# EasyEDA Pro project ProPrj_FOC12_2025-04-03.epro, board PCB2
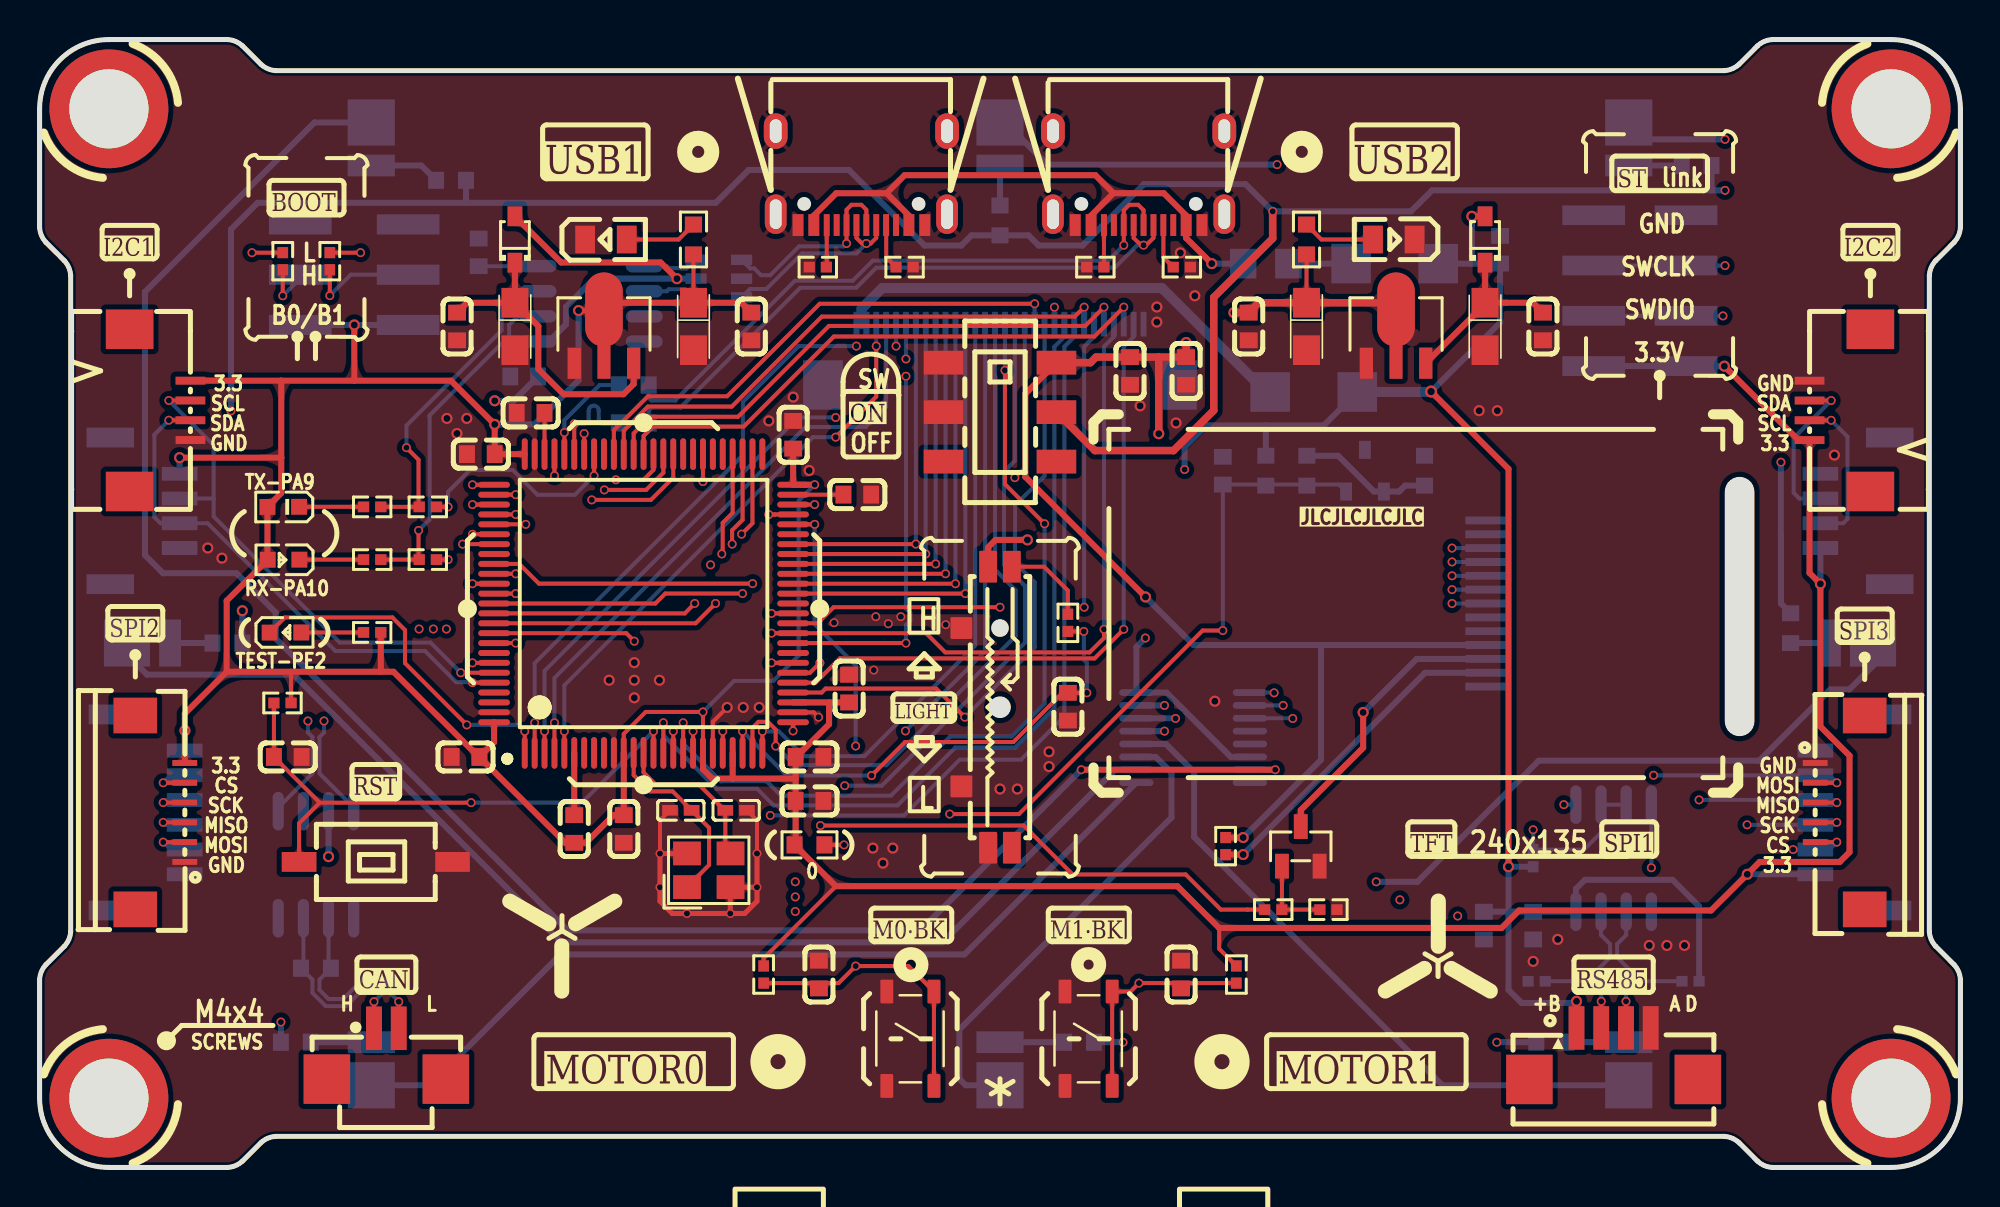
[diagram p10: board, top side]
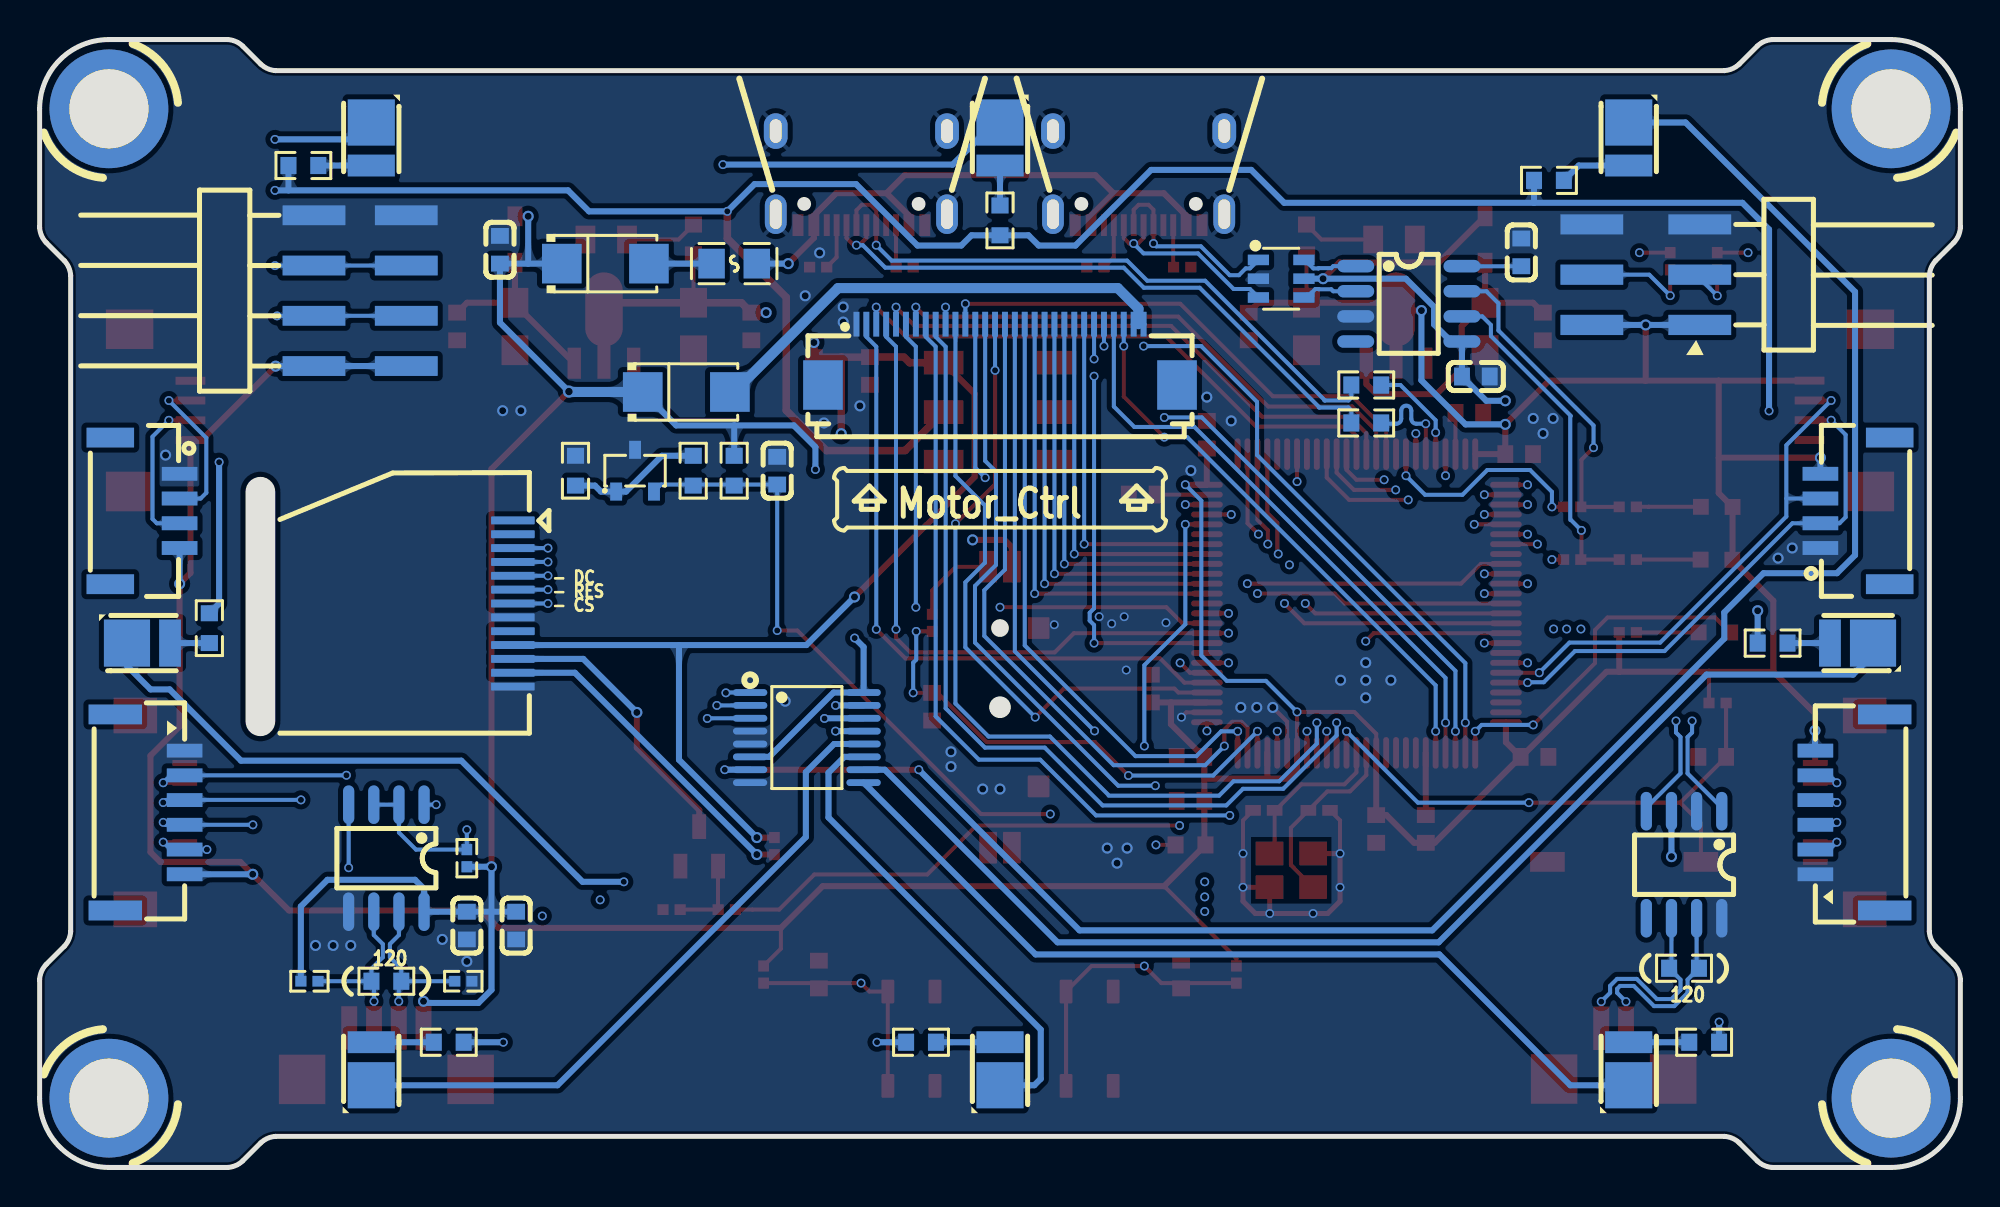
[diagram p11: board, bottom side, seen from below]

Outline 97 x 57 mm; copper layers: Top Layer, Inner1, Inner2, Bottom Layer. Coordinates in mm from the lower left corner of the outline.
Outline path: 0,53.5 0,47.5 arc(0.1,47.1) 0.33,46.75 1.24,45.83 arc(1.47,45.48) 1.57,45.08 1.57,11.92 arc(1.47,11.52) 1.24,11.17 0.33,10.25 arc(0.1,9.9) 0,9.5 0,3.5 arc(1.03,1.03) 3.5,0 9.5,0 arc(9.9,0.1) 10.25,0.32 11.17,1.24 arc(11.52,1.47) 11.92,1.57 85.08,1.57 arc(85.48,1.47) 85.83,1.24 86.75,0.32 arc(87.1,0.1) 87.5,0 93.5,0 arc(95.97,1.03) 97,3.5 97,9.5 arc(96.9,9.9) 96.68,10.25 95.76,11.17 arc(95.53,11.52) 95.43,11.92 95.43,45.08 arc(95.53,45.48) 95.76,45.83 96.68,46.75 arc(96.9,47.1) 97,47.5 97,53.5 arc(95.97,55.97) 93.5,57 87.5,57 arc(87.1,56.9) 86.75,56.67 85.83,55.76 arc(85.48,55.53) 85.08,55.43 11.92,55.43 arc(11.52,55.53) 11.17,55.76 10.25,56.67 arc(9.9,56.9) 9.5,57 3.5,57 arc(1.03,55.97) 0,53.5
Stack: Top Layer 0.035mm 外层铜厚1oz / Dielectric1 0.2104mm 7628 RC49% 8.6mil / Inner1 0.0152mm 内层铜厚 / Dielectric2 1.065mm 1.1mm H/HOZ Copper / Inner2 0.0152mm 内层铜厚 / Dielectric3 0.2104mm 7628 RC49% 8.6mil / Bottom Layer 0.035mm 外层铜厚1oz

## Design rules (mm)
net D+: DP1
net D-: DP1
net USB-: DP3
net USB+: DP3
net $1N25478: DP6
net $1N25477: DP6
net CAN_L: DP5
net CAN_H: DP5
net OTG_D+: DP2
net OTG_D-: DP2
net PA12: DP4
net PA11: DP4
net CAN1_TX: DP7
net CAN1_RX: DP7
template: 自定义配置
spacing copperThickness1oz (default): track to track 0.102, other pairs 0.152 to 0.3
spacing copperThickness2oz: track to track 0.203, other pairs 0.152 to 0.3
track width copperThickness1oz (default): min 0.127, default 0.254, max 2.54
track width copperThickness2oz: min 0.203, default 0.254, max 2.54
differential pair differentialPair (default): width min 0.127, default 0.254, max 2.54; gap min 0.152, default 0.152
via viaSize (default): diameter min 0.45, default 0.61, max 10; hole min 0.3, default 0.305, max 6.299

## Placement (name value [footprint] x y rotation side)
C1  1uF  [C0603]  27 17.1 90 top
C2  14pF  [C0402]  35.18 18.05 0 top
C3  22uF  [CASE-A_3216]  24 42.5 270 top
C4  100nF  [C0603]  21.08 42.5 90 top
C5  22uF  [CASE-A_3216]  33.02 42.5 270 top
C6  100nF  [C0603]  35.94 42.5 90 top
C7  22uF  [CASE-A_3216]  73 42.5 270 top
C8  100nF  [C0603]  75.92 42.5 90 top
C9  22uF  [CASE-A_3216]  63.98 42.5 270 top
C10  100nF  [C0603]  61.06 42.5 90 top
C11  100nF  [C0603]  59.75 35.21 270 bottom
C12  14pF  [C0402]  32.38 18.05 180 top
C13  2.2uF  [C0603]  24.8 38.13 0 top
C15  100nF  [C0603]  22.28 36.05 0 top
C16  100nF  [C0603]  38.06 37.03 270 top
C17  100nF  [C0603]  21.51 20.75 0 top
C18  100nF  [C0603]  40.88 24.2 270 top
C19  100nF  [C0603]  38.88 18.52 180 top
C20  100nF  [C0603]  38.88 20.75 180 top
C21  100nF  [C0603]  29.5 17.1 90 top
C23  2.2uF  [C0603]  41.29 34 180 top
C24  4.7uF  [C0603]  72.94 12.22 90 bottom
C25  2.2uF  [C0603]  73.75 46.38 270 bottom
C26  100nF  [C0603]  22.17 46.24 90 bottom
C27  100nF  [C0603]  75.42 12.22 90 bottom
C28  100nF  [C0603]  12.53 20.75 180 top
C29  100nF  [C0603]  24.47 39.97 0 bottom
C30  100nF  [C0603]  55.07 40.25 90 top
C31  4.7uF  [C0603]  57.9 40.25 90 top
C32  100nF  [C0603]  39.36 9.75 270 top
C33  100nF  [C0603]  57.64 9.75 270 top
C34  4.7uF  [C0603]  51.93 23.28 270 top
CN1  HC-1.25-4PWT  [CONN-SMD_4P-P1.25-HC-1.25-4PWT]  79.49 5.75 0 top
CN2  HC-GH-4PWT  [CONN-SMD_HC-GH-4PWT]  5.32 33.18 90 bottom
CN3  HC-GH-4PWT  [CONN-SMD_HC-GH-4PWT]  91.68 33.18 270 bottom
CN4  HC-1.25-2PWT  [CONN-SMD_2P-P1.25-HC-1.25-2PWT]  17.51 5.75 0 top
D1  1N5819WS  [SOD-323_L1.8-W1.3-LS2.5-RD]  24 46.9 90 top
D2  1N5819WS  [SOD-323_L1.8-W1.3-LS2.5-RD]  73 46.9 90 top
D3  USBLC6-2SC6  [SOT-23-6_L2.9-W1.6-P0.95-LS2.8-BL]  34.3 44.92 270 bottom
D4  SS34  [SMA_L4.3-W2.6-LS5.2-RD]  68.43 45.68 180 bottom
D5  SS34  [SMA_L4.3-W2.6-LS5.2-RD]  64.34 39.19 180 bottom
F1  SMD0805-100  [F0805]  61.92 45.68 0 bottom
FPC1  FPC-05F-30PH20  [FPC-SMD_30P-P0.50_XUNPU_FPC-05F-30PH20]  48.5 41.08 180 bottom
FPC2  AFA01-S04FCC-00  [FPC-SMD_AFA01-S04FCC-00]  6.08 38.26 270 top
FPC3  AFA01-S04FCC-00  [FPC-SMD_AFA01-S04FCC-00]  90.92 38.26 90 top
FPC4  AFA01-S06FCC-00  [FPC-SMD_6P-P1.00_AFA01-S06]  6.08 17.94 270 top
FPC5  AFA01-S06FCC-00  [FPC-SMD_6P-P1.00_AFA01-S06]  90.92 17.94 90 top
H1  PZ254-2-04-WS  [HDR-SMD_8P-P2.54-H-M-R2-C4_2]  80.81 44.31 270 bottom
LED1  XL-1608UGC-04_绿  [LED0603-RD_GREEN]  12.31 33.38 180 top
LED2  XL-1608UBC-04_蓝  [LED0603-RD_BLUE]  12.32 30.71 180 top
LED3  KT-0805Y_黄  [LED0805-R-RD]  68.39 46.9 180 top
LED4  NCD0603R1_红  [LED0603-RD_RED]  12.42 27.03 0 top
LED5  KT-0805Y_黄  [LED0805-R-RD]  28.6 46.9 0 top
LED6  HL-AM-2835H489W-S1-08HL-HR3  [LED-SMD_L3.3-W2.8-RD]  48.5 51.72 270 bottom
LED7  HL-AM-2835H489W-S1-08HL-HR3  [LED-SMD_L3.3-W2.8-RD]  80.25 51.72 270 bottom
LED8  HL-AM-2835H489W-S1-08HL-HR3  [LED-SMD_L3.3-W2.8-RD]  91.5 26.5 180 bottom
LED9  HL-AM-2835H489W-S1-08HL-HR3  [LED-SMD_L3.3-W2.8-RD]  80.25 5.24 90 bottom
LED10  HL-AM-2835H489W-S1-08HL-HR3  [LED-SMD_L3.3-W2.8-RD]  48.5 5.24 90 bottom
LED11  HL-AM-2835H489W-S1-08HL-HR3  [LED-SMD_L3.3-W2.8-RD]  5.5 26.5 0 bottom
LED12  HL-AM-2835H489W-S1-08HL-HR3  [LED-SMD_L3.3-W2.8-RD]  16.75 51.72 270 bottom
LED13  HL-AM-2835H489W-S1-08HL-HR3  [LED-SMD_L3.3-W2.8-RD]  16.75 5.24 90 bottom
NOREF  -  [Pad_e236]  93.5 53.5 90 top
NOREF#2  -  [Pad_e219]  93.5 3.5 0 top
NOREF#3  -  [Pad_e35]  3.5 3.5 270 top
NOREF#4  -  [Pad_e18]  3.5 53.5 180 top
Q1  AMS1117-3.3V  [SOT-89-3_L4.5-W2.5-P1.50-LS4.2-BR]  28.5 42 270 top
Q2  AMS1117-3.3V  [SOT-89-3_L4.5-W2.5-P1.50-LS4.2-BR]  68.5 42 270 top
Q3  S8050  [SOT-23-3_L2.9-W1.3-P1.90-LS2.4-BR]  63.69 16.23 270 top
R1  0603WAF1001T5E  [R0603]  61.92 35.21 270 bottom
R2  1.5kΩ  [R0603]  63.99 35.21 270 bottom
R3  4.7kΩ  [R0603]  69.94 35.21 270 bottom
R4  0Ω  [R0603]  38.88 16.3 0 top
R5  3kΩ  [R0402]  16.8 33.38 0 top
R6  3kΩ  [R0603]  63.98 46.9 270 top
R7  3kΩ  [R0402]  16.8 27.04 0 top
R8  100Ω  [R0402]  19.6 33.38 0 top
R9  1kΩ  [R0402]  16.8 30.72 0 top
R10  10kΩ  [R0402]  12.28 45.8 270 top
R11  10kΩ  [R0402]  14.65 45.8 270 top
R12  100Ω  [R0402]  19.6 30.72 0 top
R13  3kΩ  [R0603]  33.02 46.9 270 top
R14  10kΩ  [R0402]  12.27 23.47 0 top
R15  0402WGF5101TCE  [R0402]  43.68 45.5 180 top
R16  0402WGF5101TCE  [R0402]  57.68 45.5 180 top
R17  10kΩ  [R0402]  75.42 15.63 90 bottom
R18  0Ω  [R0603]  30 39.54 180 bottom
R19  0Ω  [R0603]  30 37.62 180 bottom
R20  1kΩ  [R0402]  75.6 9.41 180 bottom
R21  0402WGF5101TCE  [R0402]  39.3 45.5 0 top
R22  120Ω  [R0603]  79.49 9.41 180 bottom
R23  0402WGF5101TCE  [R0402]  53.32 45.5 0 top
R24  1kΩ  [R0402]  83.37 9.41 0 bottom
R25  1kΩ  [R0402]  51.93 27.52 90 top
R26  20Ω  [R0402]  59.89 16.24 90 top
R27  10kΩ  [R0402]  62.3 13.03 0 top
R28  10kΩ  [R0402]  36.56 9.75 270 top
R29  10kΩ  [R0402]  60.44 9.75 270 top
R30  10kΩ  [R0402]  65.09 13.03 0 top
R31  120Ω  [R0603]  13.96 10.07 180 bottom
R32  0603WAF1000T5E  [R0603]  48.5 47.86 270 bottom
R33  0603WAF1000T5E  [R0603]  83.68 50.64 0 bottom
R34  0603WAF1000T5E  [R0603]  88.43 27.25 90 bottom
R35  0603WAF1000T5E  [R0603]  76.34 6.33 180 bottom
R36  0603WAF1000T5E  [R0603]  52.49 6.33 0 bottom
R37  0603WAF1000T5E  [R0603]  20.78 49.89 0 bottom
R38  0603WAF1000T5E  [R0603]  9.48 26.5 0 bottom
R39  0603WAF1000T5E  [R0603]  12.94 6.33 180 bottom
SW1  TS-1107S-16  [SW-SMD_L6.0-W3.7-LS8.0]  16.98 15.44 180 top
SW2  MST22D18G2  [SW-SMD_MST22D18G2]  48.5 38.17 270 top
SW3  K2-1808SN-A3SW-01  [椭圆白头按钮开关]  44 6.5 90 top
SW4  K2-1808SN-A3SW-01  [椭圆白头按钮开关]  53 6.5 90 top
U1  STM32F407VET6  [LQFP-100_L14.0-W14.0-P0.50-LS16.0-BL]  30.5 28.5 0 top
U2  TL431  [SOT-23-3_L2.9-W1.4-P1.90-LS2.6-BR]  66.93 35.21 270 bottom
U4  PZ254-2-03-WS  [HDR-SMD_6P-P2.54-H-M-R2-C3-LS17.0]  15.89 45.12 90 bottom
U5  CH340N  [SOP-8_L4.9-W3.9-P1.27-LS6.0-BL]  27.85 43.64 270 bottom
U6  MAX13488EESA+T  [SOIC-8_L5.0-W4.0-P1.27-LS6.0-BL]  79.49 15.63 0 bottom
U7  -  [1.14 TFT_13P]  69.5 28.5 0 top
U8  HC-GH-6PWT  [CONN-SMD_6P-P1.25_HCTL_HC-GH-6PWT]  5.57 17.94 90 bottom
U9  HC-GH-6PWT  [CONN-SMD_6P-P1.25_HCTL_HC-GH-6PWT]  91.43 17.94 270 bottom
U10  -  [RS08U111Z001]  48.5 23.26 0 top
U11  TJA1050T/CM,118  [SOIC-8_L5.0-W4.0-P1.27-LS6.0-BL]  13.96 15.3 0 bottom
U12  SN74HC138PWR  [TSSOP-16_L5.0-W4.4-P0.65-LS6.4-BL]  58.25 21.72 270 bottom
USB1  TYPE-C 16PIN 2MD(073)  [USB-C-SMD_TYPE-C-6PIN-2MD-073]  41.5 50 180 top
USB2  TYPE-C 16PIN 2MD(073)  [USB-C-SMD_TYPE-C-6PIN-2MD-073]  55.5 50 180 top
X1  25MHz  [CRYSTAL-SMD_4P-L3.2-W2.5-BL]  33.79 15.02 0 top

## Footprints (pads in the part's own frame, mm; a bottom-side part is the same pattern mirrored in y, then rotated)
1.14 TFT_13P
  rrect 2.2x0.4 smd far side: 1(3.6,4.2) 2(3.6,3.5) 3(3.6,2.8) 4(3.6,2.1) 5(3.6,1.4) 6(3.6,0.7) 7(3.6,0) 8(3.6,-0.7) 9(3.6,-1.4) 10(3.6,-2.1) 11(3.6,-2.8) 12(3.6,-3.5) 13(3.6,-4.2)
C0402
  rect 0.79x0.54 smd: 1(-0.545,0) 2(0.545,0)
C0603
  rect 0.8x0.9 smd: 1(-0.7,0) 2(0.7,0)
CASE-A_3216
  rect 1.5x1.359 smd: 1(-1.2,0) 2(1.2,0)
CONN-SMD_2P-P1.25-HC-1.25-2PWT
  rect 0.8x2.2 smd: 1(-0.625,1.285) 2(0.625,1.285)
  rect 2.35x2.5 smd: 3(-3.005,-1.285) 4(3.005,-1.285)
CONN-SMD_4P-P1.25-HC-1.25-4PWT
  rect 0.8x2.2 smd: 1(-1.875,1.3) 2(-0.625,1.3) 3(0.625,1.3) 4(1.875,1.3)
  rect 2.35x2.5 smd: 5(4.255,-1.3) 6(-4.255,-1.3)
CONN-SMD_6P-P1.25_HCTL_HC-GH-6PWT
  rect 0.7x1.8 smd: 1(-3.125,1.75) 2(-1.875,1.75) 3(-0.625,1.75) 4(0.625,1.75) 5(1.875,1.75) 6(3.125,1.75)
  rect 1x2.7 smd: 7(4.955,-1.75) 8(-4.955,-1.75)
CONN-SMD_HC-GH-4PWT
  rect 0.7x1.8 smd: 1(-1.875,1.75) 2(-0.625,1.75) 3(0.625,1.75) 4(1.875,1.75)
  rect 1x2.4 smd: 5(3.705,-1.75) 6(-3.705,-1.75)
CRYSTAL-SMD_4P-L3.2-W2.5-BL
  rect 1.4x1.2 smd: 1(-1.1,-0.85) 2(1.1,-0.85) 3(1.1,0.85) 4(-1.1,0.85)
F0805
  rect 1.335x1.5 smd: 1(-1.143,0) 2(1.143,0)
FPC-SMD_6P-P1.00_AFA01-S06
  rect 0.299x1.25 smd: 1(2.499,1.25) 2(1.501,1.25) 3(0.5,1.25) 4(-0.5,1.25) 5(-1.498,1.25) 6(-2.499,1.25)
  rect 1.801x2.2 smd: 7(4.899,-1.25) 8(-4.899,-1.25)
FPC-SMD_30P-P0.50_XUNPU_FPC-05F-30PH20
  rect 0.3x1.25 smd: 1(-7.25,1.538) 2(-6.75,1.538) 3(-6.25,1.538) 4(-5.75,1.538) 5(-5.25,1.538) 6(-4.75,1.538) 7(-4.25,1.538) 8(-3.75,1.538) 9(-3.25,1.538) 10(-2.75,1.538) 11(-2.25,1.538) 12(-1.75,1.538) 13(-1.25,1.538) 14(-0.75,1.538) 15(-0.25,1.538) 16(0.25,1.538) 17(0.75,1.538) 18(1.25,1.538) 19(1.75,1.538) 20(2.25,1.538) 21(2.75,1.538) 22(3.25,1.538) 23(3.75,1.538) 24(4.25,1.538) 25(4.75,1.538) 26(5.25,1.538) 27(5.75,1.538) 28(6.25,1.538) 29(6.75,1.538) 30(7.25,1.538)
  rect 2x2.5 smd: 31(8.94,-1.538) 32(-8.94,-1.538)
FPC-SMD_AFA01-S04FCC-00
  rect 0.399x1.501 smd: 1(-1.501,1.536) 2(-0.5,1.536) 3(0.498,1.536) 4(1.498,1.536)
  rect 1.999x2.401 smd: 5(-4.099,-1.536) 6(4.099,-1.536)
HDR-SMD_6P-P2.54-H-M-R2-C3-LS17.0
  rect 1.02x3.17 smd: 1(-2.54,-2.725) 2(-2.54,2.725) 3(0,-2.725) 4(0,2.725) 5(2.54,-2.725) 6(2.54,2.725)
HDR-SMD_8P-P2.54-H-M-R2-C4_2
  rect 1x3.17 smd: 1(-3.81,2.33) 2(-3.81,-2.33) 3(-1.27,2.33) 4(-1.27,-2.33) 5(1.27,2.33) 6(1.27,-2.33) 7(3.81,2.33) 8(3.81,-2.33)
LED0603-RD_BLUE
  rect 0.8x0.8 smd: 1(-0.8,-0.003) 2(0.8,0.003)
LED0603-RD_GREEN
  rect 0.8x0.8 smd: 1(-0.799,-0.004) 2(0.799,0.004)
LED0603-RD_RED
  rect 0.8x0.8 smd: 1(-0.799,-0.004) 2(0.799,0.004)
LED0805-R-RD
  rect 1x1.399 smd: 1(1.05,0) 2(-1.05,0)
LED-SMD_L3.3-W2.8-RD
  rect 2.33x2.38 smd: 1(-1.087,0)
  rect 1.1x2.38 smd: 2(1.087,0)
LQFP-100_L14.0-W14.0-P0.50-LS16.0-BL
  oval 0.3x1.6 smd: 1(-6,-7.55) 2(-5.5,-7.55) 3(-5,-7.55) 4(-4.5,-7.55) 5(-4,-7.55) 6(-3.5,-7.55) 7(-3,-7.55) 8(-2.5,-7.55) 9(-2,-7.55) 10(-1.5,-7.55) 11(-1,-7.55) 12(-0.5,-7.55) 13(0,-7.55) 14(0.5,-7.55) 15(1,-7.55) 16(1.5,-7.55) 17(2,-7.55) 18(2.5,-7.55) 19(3,-7.55) 20(3.5,-7.55) 21(4,-7.55) 22(4.5,-7.55) 23(5,-7.55) 24(5.5,-7.55) 25(6,-7.55) 51(6,7.55) 52(5.5,7.55) 53(5,7.55) 54(4.5,7.55) 55(4,7.55) 56(3.5,7.55) 57(3,7.55) 58(2.5,7.55) 59(2,7.55) 60(1.5,7.55) 61(1,7.55) 62(0.5,7.55) 63(0,7.55) 64(-0.5,7.55) 65(-1,7.55) 66(-1.5,7.55) 67(-2,7.55) 68(-2.5,7.55) 69(-3,7.55) 70(-3.5,7.55) 71(-4,7.55) 72(-4.5,7.55) 73(-5,7.55) 74(-5.5,7.55) 75(-6,7.55)
  oval 1.6x0.3 smd: 26(7.55,-6) 27(7.55,-5.5) 28(7.55,-5) 29(7.55,-4.5) 30(7.55,-4) 31(7.55,-3.5) 32(7.55,-3) 33(7.55,-2.5) 34(7.55,-2) 35(7.55,-1.5) 36(7.55,-1) 37(7.55,-0.5) 38(7.55,0) 39(7.55,0.5) 40(7.55,1) 41(7.55,1.5) 42(7.55,2) 43(7.55,2.5) 44(7.55,3) 45(7.55,3.5) 46(7.55,4) 47(7.55,4.5) 48(7.55,5) 49(7.55,5.5) 50(7.55,6) 76(-7.55,6) 77(-7.55,5.5) 78(-7.55,5) 79(-7.55,4.5) 80(-7.55,4) 81(-7.55,3.5) 82(-7.55,3) 83(-7.55,2.5) 84(-7.55,2) 85(-7.55,1.5) 86(-7.55,1) 87(-7.55,0.5) 88(-7.55,0) 89(-7.55,-0.5) 90(-7.55,-1) 91(-7.55,-1.5) 92(-7.55,-2) 93(-7.55,-2.5) 94(-7.55,-3) 95(-7.55,-3.5) 96(-7.55,-4) 97(-7.55,-4.5) 98(-7.55,-5) 99(-7.55,-5.5) 100(-7.55,-6)
Pad_e18
  round 6 hole 4: 1(0,0)
Pad_e35
  round 6 hole 4: 1(0,0)
Pad_e219
  round 6 hole 4: 1(0,0)
Pad_e236
  round 6 hole 4: 1(0,0)
R0402
  rect 0.566x0.54 smd: 1(-0.433,0) 2(0.433,0)
R0603
  rect 0.806x0.864 smd: 1(-0.753,0) 2(0.753,0)
RS08U111Z001
  rrect 0.9x1.6 smd: 1(-0.6,7.1) 2(0.6,7.1) 3(0.6,-7.1) 4(-0.6,-7.1)
  rrect 1.1x1.1 smd: 5(-1.95,-4) 6(-1.95,4)
SMA_L4.3-W2.6-LS5.2-RD
  rect 2x2 smd: 1(-2.2,0) 2(2.2,0)
SOD-323_L1.8-W1.3-LS2.5-RD
  rect 1x0.75 smd: 1(-1.173,0) 2(1.173,0)
SOIC-8_L5.0-W4.0-P1.27-LS6.0-BL
  oval 0.569x1.95 smd: 1(-1.905,-2.705) 2(-0.635,-2.705) 3(0.635,-2.705) 4(1.905,-2.705) 5(1.905,2.705) 6(0.635,2.705) 7(-0.635,2.705) 8(-1.905,2.705)
SOP-8_L4.9-W3.9-P1.27-LS6.0-BL
  oval 0.63x1.865 smd: 1(-1.905,-2.683) 2(-0.635,-2.683) 3(0.635,-2.683) 4(1.905,-2.683) 5(1.905,2.683) 6(0.635,2.683) 7(-0.635,2.683) 8(-1.905,2.683)
SOT-23-3_L2.9-W1.3-P1.90-LS2.4-BR
  rect 1.25x0.7 smd: 1(1,-0.95) 2(1,0.95) 3(-1,0)
SOT-23-3_L2.9-W1.4-P1.90-LS2.6-BR
  rect 0.91x0.6 smd: 1(1.055,-0.955) 2(1.055,0.955) 3(-1.055,0)
SOT-23-6_L2.9-W1.6-P0.95-LS2.8-BL
  rect 0.532x1.072 smd: 1(-0.95,-1.149) 2(0,-1.149) 3(0.95,-1.149) 4(0.95,1.149) 5(0,1.149) 6(-0.95,1.149)
SOT-89-3_L4.5-W2.5-P1.50-LS4.2-BR
  rect 1.575x0.672 smd: 1(1.356,-1.5) 3(1.356,1.5)
  custom 5.377x1.9 smd: 2(-1.356,0)
SW-SMD_L6.0-W3.7-LS8.0
  rect 1.75x1 smd: 1(-3.875,0) 2(3.875,0)
SW-SMD_MST22D18G2
  rect 1.2x2 smd: 1(-2.5,2.85) 2(0,2.85) 3(2.5,2.85) 4(-2.5,-2.85) 5(0,-2.85) 6(2.5,-2.85)
TSSOP-16_L5.0-W4.4-P0.65-LS6.4-BL
  oval 0.343x1.732 smd: 1(-2.276,-2.865) 2(-1.625,-2.865) 3(-0.976,-2.865) 4(-0.325,-2.865) 5(0.325,-2.865) 6(0.976,-2.865) 7(1.625,-2.865) 8(2.276,-2.865) 9(2.276,2.865) 10(1.625,2.865) 11(0.976,2.865) 12(0.325,2.865) 13(-0.325,2.865) 14(-0.976,2.865) 15(-1.625,2.865) 16(-2.276,2.865)
USB-C-SMD_TYPE-C-6PIN-2MD-073
  rect 0.55x1.1 smd: 1(-3.2,2.375) 2(-2.4,2.375) 11(2.4,2.375) 12(3.2,2.375)
  rect 0.3x1.1 smd: 3(-1.75,2.375) 4(-1.25,2.375) 5(-0.75,2.375) 6(-0.25,2.375) 7(0.25,2.375) 8(0.75,2.375) 9(1.25,2.375) 10(1.75,2.375)
  oval 1.1x2 hole 0.6x1.5: 13(-4.325,1.825) 14(4.325,1.825)
  oval 1.2x1.8 hole 0.6x1.2: 13(-4.325,-2.375) 14(4.325,-2.375)
椭圆白头按钮开关
  rrect 1.2x0.65 smd: 1(-2.38,-1.164) 2(2.39,-1.164) 3(2.39,1.216) 4(-2.38,1.216)

## Nets
As in the schematic.

Pads without a net: CN1 5 6; CN2 5 6; CN3 5 6; CN4 3 4; FPC1 31 32; FPC2 5 6; FPC3 5 6; FPC4 7 8; FPC5 7 8; NOREF 1; NOREF#2 1; NOREF#3 1; NOREF#4 1; SW2 3 6; U1 7 8 9 33 38 45 51 55 56 58 59 67 83 93 97 98; U5 4; U7 1 2 9; U8 7 8; U9 7 8; U10 3; U11 5; USB1 3 9; USB2 3 9

## Via types
v1: diameter 0.559, hole 0.355, Top Layer to Bottom Layer, 62 vias
v2: diameter 0.45, hole 0.305, Top Layer to Bottom Layer, 183 vias
v3: diameter 0.61, hole 0.381, Top Layer to Bottom Layer, 1 via

## Routing (per net, layer and track width the routed paths; a pad name or vN(x,y) marks a point on that pad's centre or on a via; arc(x,y) is an arc through that point)
+3.3V_1: length 255.6
  Top Layer w0.203: R29.1 59.57,11.05 59.57,12.1 ; 11.51,30.72 11.52,30.71 ; U1.19 v2(33.5,23.02) 30.61,23.02 29.5,21.91 U1.11 ; C5.1 R13.2 ; R28.1 36.56,10.57 40.21,14.22 ; R14.2 12.7,25.05 ; 39.14,34.5 v2(39.14,34.5)
  Top Layer w0.305: 35,19.65 33.97,19.65 33.5,20.12 U1.19 ; 35,19.65 U1.22 ; 35,19.65 38.18,19.65 ; 12.2,39.76 15.89,39.76 ; 12.2,39.76 12.2,35.87 ; 12.2,39.76 7.62,39.76 ; 15.89,39.76 v1(15.89,42.58) ; 15.89,39.76 20.77,39.76 v1(22.98,37.55) C15.2 24.5,36.05 ; v1(27.22,43.31) 28.45,43.31 Q1.2 28.84,43.7 C5.1 35.44,43.7 C6.2 ; 40.91,23.5 39.87,23.5 ; 39.87,23.5 U1.28 ; 39.87,23.5 39.87,22.4 38.21,20.75 ; 12.2,35.87 v1(7.07,35.87) ; 12.2,35.87 12.2,34.08 LED1.2 11.51,30.72 ; 17.23,25.05 9.45,25.05 ; 17.23,25.05 17.87,25.05 22.17,20.75 ; 17.23,25.05 17.23,27.04 ; U1.11 C21.2 28.98,17.8 27.58,16.4 C1.1 26.55,16.4 C17.2 22.95,21.49 U1.100 ; 9.45,25.05 7.33,22.94 FPC4.6 ; 9.45,25.05 9.45,28.64 11.52,30.71 ; 38.18,16.35 C19.2 38.18,19.65 ; C16.2 38.06,34.5 ; C20.2 38.18,19.65 ; U1.50 39.14,34.5 ; R4.1 40.21,14.22 57.46,14.22 59.57,12.1 73.83,12.1 74.71,12.99 84.41,12.99 v1(86.24,14.82) 86.86,15.44 FPC5.6 90.91,15.44 91.4,15.93 91.4,20.81 89.93,22.28 v1(89.93,29.49) 89.38,30.04 FPC3.1 88.82,36.76 v1(85.08,40.5)
  Bottom Layer w0.203: v2(39.14,34.5) 38.33,33.7 38.33,25.87 37.05,24.59 35.07,24.59 v2(33.5,23.02)
  Bottom Layer w0.305: v1(22.98,37.55) 24.99,37.55 27.22,39.78 v1(27.22,43.31) ; U4.2 v1(15.89,42.58) U4.1 ; v1(89.93,29.49) CN3.4 ; v1(7.34,22.08) 7.34,21.08 U8.6 ; v1(86.24,14.82) U9.6 ; CN2.4 v1(7.07,35.87) ; H1.7 H1.8 ; 83.51,40.5 v1(85.08,40.5)
+3.3V_2: length 84.6
  Top Layer w0.203: R6.2 C9.1
  Top Layer w0.305: U10.1 47.9,31.34 48.27,31.72 v1(49.88,31.72) ; v1(55.85,28.83) 49.78,34.9 49.78,39.1 SW2.1 ; v1(60.78,16.67) R26.2
  Top Layer w0.381: v1(57.9,41.69) C31.2 56.52,40.95 ; Q2.2 68.16,43.7 C9.1 61.56,43.7 C10.2 v1(60.31,43.2) ; SW2.1 53.07,40.67 53.35,40.95 C30.2 56.52,40.95 ; 56.52,40.95 v1(56.52,37.08)
  Inner1 w0.508: v1(57.9,41.69) 59.41,43.2 v1(60.31,43.2)
  Inner2 w0.305: v1(56.52,37.08) 56.52,33.96 54.27,31.72 v1(49.88,31.72)
  Bottom Layer w0.305: 64.71,26.4 64.71,20.6 v1(60.78,16.67) ; 64.71,26.4 U7.10 ; 64.71,26.4 58.28,26.4 v1(55.85,28.83)
+5V: length 200.9
  Top Layer w0.305: 73,48.07 v1(72.33,48.07) ; D1.2 26.34,45.73 31.36,45.73 v1(32.18,44.92) ; 70.28,39.2 74.18,35.3 v1(74.18,15.2) ; CN1.1 77.61,8.39
  Top Layer w0.381: v3(70.27,39.21) 70.28,39.2
  Inner1 w0.305: v1(22.98,38.75) 19.88,38.75 18,36.87 18,29.79 12.53,24.33 12.53,21.75 14.59,19.69 v1(14.59,15.71)
  Inner1 w0.508: v1(32.18,44.92) 60.62,44.92 61.06,45.36 64.12,45.36 v3(70.27,39.21)
  Inner2 w0.305: v2(55.84,26.75) 57.82,28.73 v2(57.82,35.27)
  Bottom Layer w0.305: C24.2 74.18,12.92 ; 74.18,12.92 74.18,8.97 74.84,8.31 77.53,8.31 v1(77.61,8.4) ; 74.18,12.92 C27.2 U6.8 77.58,14.08 78.04,14.54 82.46,14.54 83.81,13.19 R24.2 ; 74.18,12.92 v1(74.18,15.2) R17.1 ; D5.1 64.85,37.5 61.92,37.5 ; v2(55.84,26.75) 55.39,26.3 U12.16 56.91,24 60.16,20.75 61.12,20.75 ; 72.33,45.68 C25.2 73.75,42.69 v3(70.27,39.21) ; 72.33,45.68 D4.1 ; 72.33,45.68 v1(72.33,48.07) ; 14.59,17.6 v1(14.59,15.71) ; D3.5 v1(32.18,44.92) 28,44.92 26.58,43.49 26.58,42.6 25.72,41.74 U5.5 C29.2 23.94,38.75 v1(22.98,38.75) ; 61.92,37.5 R1.1 ; 61.92,37.5 58.92,37.5 57.82,36.41 v2(57.82,35.27)
  Bottom Layer w0.508: D5.1 70.25,39.19
DGND: length 23.1
  Top Layer w0.203: v2(31.33,15.86) 31.33,17.54 C12.2 ; v1(34.72,23.25) 34,22.52 U1.20 ; U1.27 39.09,23 v2(39.34,22.75) ; v2(36.23,15.86) 36.23,17.54 C2.2
  Top Layer w0.254: v2(34.88,12.83) 34.88,14.15 X1.2 34.9,14.16 v2(36.23,14.16) ; v2(34.88,12.83) 35.61,12.83 36.23,13.45 v2(36.23,14.16) ; v2(34.88,12.83) v2(32.69,12.83) 31.95,12.83 31.33,13.45 v2(31.33,14.16) v2(31.33,15.86) 32.69,15.86 X1.4 ; v2(36.23,14.16) v2(36.23,15.86)
  vias: v1(8.49,31.31) v1(9.21,30.79) v1(20.57,37.85) v1(21.08,37.09) v1(21.57,37.85) v1(28.76,24.62) v1(30.03,25.51) v1(30.03,24.62) v1(30.03,23.73) v1(31.3,24.62) v1(35.53,23.25) v1(36.34,23.25) v1(36.82,37.73) v1(38.06,38.93) v1(38.86,35.22) v1(42.08,16.14) v1(42.59,15.38) v1(43.09,16.14) v1(48.5,19.12) v1(49.38,19.12) v1(50.97,21.01) v1(50.97,20.26) v1(55.58,38.49) v1(56.42,43.48) v1(56.42,42.72) v1(57.39,37.62) v1(57.61,46.22) v1(58.34,44.05) v1(59.35,23.56) v1(72.7,38.25) v1(73.62,38.25) v1(75.42,10.41) v1(76.67,11.52) v1(81.29,11.22) v1(82.18,11.22) v1(83.07,11.22) v1(90.64,36) v2(40.12,27.53) v2(42.12,25.14) v2(42.23,27.83) v2(42.86,27.48) v2(43.49,27.83) v2(45.76,27.43)
VCC_+3.3V_2: length 228.4
  Top Layer w0.381: v2(62.27,48.32) 62.27,46.95 59.29,43.97 59.29,38.26 57.26,36.23 53.29,36.23 SW2.2
  Inner1 w0.305: v1(10.24,28.14) 10.24,32.37 9.66,32.94 v2(9.66,38.23)
  Inner1 w0.381: v2(87.94,35.64) 87.94,46.56 v2(85.11,49.38) ; v2(12.19,7.35) 10.24,9.3 v1(10.24,28.14)
  Inner2 w0.381: v2(87.94,35.64) 87.94,20.68 v2(73.59,6.33) ; 73.57,6.34 73.56,6.33 v2(54.71,6.33)
  Bottom Layer w0.305: R35.2 73.61,6.33 73.59,6.35 ; 21.53,48.75 11.01,48.75 9.66,47.4 v2(9.66,38.23) ; 21.53,48.75 34.15,48.75 35.81,50.41 40.87,50.41 44.69,46.59 46.54,46.59 47.06,47.11 R32.2 49.94,47.11 50.46,46.59 52.67,46.59 55.77,49.69 60.9,49.69 v2(62.27,48.32) 69.25,48.32 70.32,49.38 84.43,49.38 ; 21.53,48.75 R37.2 ; 84.43,49.38 R33.2 ; 84.43,49.38 v2(85.11,49.38) ; R38.2 v1(10.24,28.14) ; 88.43,28.01 87.94,28.5 v2(87.94,35.64) ; R39.2 v2(12.19,7.35) ; 53.24,6.33 v2(54.71,6.33)
BACKLIGHT: length 44.5
  Top Layer w0.203: v2(24.04,26.5) U1.92 ; R27.1 61,13.03 ; 61,13.03 61,13.03 ; 61,13.03 59.65,13.03 57.88,14.81 52.17,14.81 49.7,17.28 v2(39.43,17.28)
  Inner1 w0.203: v2(39.43,17.28) 38.37,17.28 35.87,19.78 32.85,19.78 32,20.63 29.91,20.63 v2(24.04,26.5)
BACKLIGHT_ADC: length 25.1
  Top Layer w0.203: v2(52.88,23.98) C34.1 51.66,23.98 49.17,21.5 43.7,21.5 v2(42.01,19.81) ; R25.1 52.73,27.09 ; v2(35.5,22.04) U1.23
  Bottom Layer w0.203: v2(35.5,22.04) 37.73,19.81 v2(42.01,19.81) ; v2(52.88,23.98) 52.88,25.51 52.73,25.66 v2(52.73,27.09)
BOOT0: length 30.1
  Top Layer w0.203: R10.1 12.28,46.23 v2(10.72,46.23) ; v2(21.86,25.5) U1.94
  Inner2 w0.203: v2(21.86,25.5) 18.33,25.5 14.29,29.55 14.29,32.96 10.72,36.52 v2(10.72,46.23)
BOOT1: length 34.4
  Top Layer w0.203: v2(36.96,28) U1.37 ; v2(16.21,46.23) R11.1
  Inner1 w0.203: v2(36.96,28) 32.39,28 25.94,34.45 25.31,34.45 24.03,35.73 24.03,41.68 19.48,46.23 v2(16.21,46.23)
CAN1_RX: length 19.9
  Top Layer w0.203: v2(21.86,32) U1.81
  Inner1 w0.203: v2(14.36,22.56) 14.36,23.04 14.13,23.27 14.13,23.97 19.99,29.83 20.92,29.83 21.86,30.77 v2(21.86,32)
  Bottom Layer w0.203: U11.4 15.86,18.19 14.13,19.91 14.13,21.75 14.36,21.98 v2(14.36,22.56) ; 15.86,17.78 15.86,17.6
CAN1_TX: length 19.9
  Top Layer w0.203: v2(21.36,31.5) U1.82
  Inner1 w0.203: v2(21.36,31.5) 21.36,30.78 20.77,30.18 19.74,30.18 13.78,24.22 13.78,23.27 13.55,23.04 v2(13.55,22.56)
  Bottom Layer w0.203: v2(13.55,22.56) 13.55,21.98 13.78,21.75 13.78,19.91 12.05,18.19 U11.1 ; 12.05,17.78 12.05,17.6
CAN_H: length 10.6
  Top Layer w0.203: v2(16.89,8.38) CN4.1
  Bottom Layer w0.203: v2(16.89,8.38) 17.33,8.83 17.33,9.03 17.19,9.17 16.49,9.17 15.47,8.15 14.45,8.15 13.78,8.82 13.78,9.49 R31.2 13.2,10.21 13.32,10.33 U11.7
CAN_L: length 10.6
  Top Layer w0.203: v2(18.14,8.38) CN4.2
  Bottom Layer w0.203: v2(18.14,8.38) 17.69,8.83 17.69,9.18 17.34,9.53 16.34,9.53 15.32,8.51 14.59,8.51 14.13,8.97 14.13,9.49 R31.1 14.71,10.21 14.59,10.33 U11.6
CH340_RX: length 16.5
  Top Layer w0.203: 17.23,33.38 19.14,33.38 19.14,35.77 v2(18.53,36.38)
  Bottom Layer w0.203: U5.7 23.94,44.28 23.33,43.67 23.33,42.3 18.53,37.5 v2(18.53,36.38)
CH340_TX: length 17.3
  Top Layer w0.203: 17.23,30.72 19.14,30.72 19.14,32.19 v2(19.14,32.19)
  Bottom Layer w0.203: 19.67,32.72 v2(19.14,32.19) ; 19.67,37.98 23.71,42.02 23.71,42.58 24.14,43.01 U5.6 ; 19.7,37.98 19.7,32.72
D+: length 10
  Top Layer w0.203: v2(40.75,46.69) USB1.8 40.75,48.4 41,48.65 41.5,48.65 41.75,48.4 USB1.6
  Bottom Layer w0.203: 35.45,45.86 35.88,45.44 36.09,45.44 36.43,45.09 36.9,45.09 38.35,46.55 40.61,46.55 v2(40.75,46.69)
D-: length 10
  Top Layer w0.203: USB1.5 42.25,46.97 41.97,46.69 v2(41.75,46.69) 41.53,46.69 41.25,46.98 USB1.7
  Bottom Layer w0.203: v2(41.75,46.69) 41.25,46.19 38.5,46.19 36.7,44.39 35.88,44.39 D3.3
LEDA: length 80.6
  Top Layer w0.203: U1.60 32,34.87 30.87,33.74 v2(27.88,33.74)
  Inner1 w0.203: v2(20.54,27.21) 20.54,22.47 19.01,20.94 19.01,17.25 26.71,9.56 47.92,9.56 v2(62.34,23.98)
  Inner2 w0.203: v2(27.88,33.74) 26.31,32.16 26.31,31.31 24.52,29.52 22.85,29.52 v2(20.54,27.21)
  Bottom Layer w0.203: 61.12,24 62.33,24 v2(62.34,23.98)
LEDB: length 83.2
  Top Layer w0.203: v2(28.52,34.24) 30.63,34.24 31.5,35.11 U1.61
  Inner1 w0.203: v2(19.88,27.21) 19.88,22.47 18.45,21.03 18.45,16.9 26.3,9.05 48.5,9.05 v2(62.8,23.35)
  Inner2 w0.203: v2(19.88,27.21) 19.88,28.38 21.99,30.49 24.71,30.49 25.78,31.55 25.78,32.47 27.55,34.24 v2(28.52,34.24)
  Bottom Layer w0.203: 61.12,23.35 v2(62.8,23.35)
LEDC: length 86.1
  Top Layer w0.203: U1.62 31,35.25 30.5,34.75 v2(29.1,34.75)
  Inner1 w0.203: v2(19.16,27.21) 19.16,22.5 17.91,21.25 17.91,16.57 26,8.49 49.08,8.49 v2(63.28,22.69)
  Inner2 w0.203: v2(19.16,27.21) 19.16,28.48 21.63,30.94 24.49,30.94 25.28,31.73 25.28,33.26 27.45,35.44 28.42,35.44 v2(29.1,34.75)
  Bottom Layer w0.203: 61.12,22.7 63.27,22.7 v2(63.28,22.69)
M0_ADC: length 31.7
  Top Layer w0.203: U1.29 39.49,24 39.69,24.2 45.28,24.2 v2(46.72,22.76)
  Bottom Layer w0.203: v2(46.72,22.76) 50.25,26.28 50.25,29.57 49.26,30.56 49.26,33.46 50.75,34.95 FPC1.11
M0_ADC_A: length 30.9
  Top Layer w0.203: v2(36.5,22.04) U1.25
  Bottom Layer w0.203: 47.25,42.61 47.25,26.38 41.65,20.78 38.59,20.78 37.33,22.04 v2(36.5,22.04)
M0_ADC_C: length 28.3
  Top Layer w0.203: U1.26 v2(38.05,22.06)
  Inner1 w0.203: v2(43.72,22.06) v2(38.05,22.06)
  Bottom Layer w0.203: 47.75,42.61 47.75,26.08 43.72,22.06
M0_BK_BUTTON: length 38.5
  Top Layer w0.203: SW3.1 SW3.2 43.88,10.18 v2(41.21,10.18) 40.35,9.32 R28.2 ; v2(39.14,32.5) U1.46
  Inner1 w0.203: v2(41.21,21.3) 41.21,10.18 v2(41.21,10.18)
  Bottom Layer w0.203: v2(39.14,32.5) 39.14,27.45 41.21,25.38 v2(41.21,21.3)
M0_BK_OUT: length 32.5
  Top Layer w0.203: v2(25,22.47) U1.2
  Inner1 w0.203: v2(41.25,41.51) 41.73,41.03 42.77,41.03 v2(43.25,41.51)
  Bottom Layer w0.203: v2(41.25,41.51) 38.34,41.51 35.52,38.69 35.52,36 25,25.48 v2(25,22.47) ; 43.25,42.66 v2(43.25,41.51)
M0_I2C1_SCL: length 27
  Top Layer w0.203: v2(6.53,38.76) FPC2.2 ; v2(21.27,25) U1.95
  Bottom Layer w0.203: 8.79,33.81 8.79,36.5 v2(6.53,38.76) ; 8.79,33.81 8.79,32.89 15.16,26.53 19.74,26.53 v2(21.27,25) ; 8.79,33.81 CN2.3
M0_I2C1_SDA: length 26.9
  Top Layer w0.203: v2(6.53,37.76) FPC2.3 ; U1.96 v2(21.86,24.5)
  Bottom Layer w0.203: v2(6.53,37.76) 5.8,37.03 5.8,32.86 6.1,32.56 CN2.2 8.48,32.56 14.94,26.1 19.46,26.1 21.04,24.52 21.84,24.52 v2(21.86,24.5)
M0_SPI2_CS: length 37.4
  Top Layer w0.203: v2(6.24,19.44) 7.33,19.44 ; U1.57 v2(33.5,34.66)
  Inner2 w0.203: v2(6.24,19.44) 15.3,19.44 18.88,23.02 22.09,23.02 33.5,34.43 v2(33.5,34.66)
  Bottom Layer w0.203: U8.5 6.62,19.81 v2(6.24,19.44)
M0_SPI2_MISO: length 41.6
  Top Layer w0.203: v2(34.97,31.5) 34.97,31.51 34.97,32.2 35.5,32.73 U1.53 ; v2(6.24,17.44) FPC4.3
  Inner2 w0.203: v2(34.97,31.5) 32.34,31.5 18.27,17.44 v2(6.24,17.44)
  Bottom Layer w0.203: v2(6.24,17.44) 6.37,17.31 U8.3
M0_SPI2_MOSI: length 41.8
  Top Layer w0.203: U1.54 35,33.08 34.5,32.58 34.5,31.05 v2(34.45,31) ; v2(6.24,16.44) FPC4.2
  Inner2 w0.203: v2(6.24,16.44) 18.15,16.44 32.71,31 v2(34.45,31)
  Bottom Layer w0.203: v2(6.24,16.44) 6.62,16.06 U8.2
M0_SPI2_SCK: length 41.3
  Top Layer w0.203: U1.52 36,32.55 v2(35.45,32) ; v2(6.24,18.44) FPC4.4
  Inner2 w0.203: v2(35.45,32) 31.96,32 18.4,18.44 v2(6.24,18.44)
  Bottom Layer w0.203: v2(6.24,18.44) 6.37,18.56 U8.4
M0_TIM1_CH1: length 21.3
  Top Layer w0.203: U1.40 v2(46.25,29.5)
  Bottom Layer w0.203: v2(46.25,29.5) 46.25,42.61
M0_TIM1_CH1N: length 22.3
  Top Layer w0.203: U1.39 v2(46.75,29)
  Bottom Layer w0.203: v2(46.75,29) 46.75,42.61
M0_TIM1_CH2: length 19.3
  Top Layer w0.203: U1.42 v2(45.25,30.5)
  Bottom Layer w0.203: v2(45.25,30.5) 45.25,42.61
M0_TIM1_CH2N: length 20.3
  Top Layer w0.203: U1.41 45.75,30 v2(45.75,30)
  Bottom Layer w0.203: 45.75,42.61 v2(45.75,30)
M0_TIM1_CH3: length 17.3
  Top Layer w0.203: U1.44 44.25,31.5 v2(44.25,31.5)
  Bottom Layer w0.203: v2(44.25,31.5) 44.25,42.61
M0_TIM1_CH3N: length 18.3
  Top Layer w0.203: v2(44.75,31) 44.75,31 U1.43
  Bottom Layer w0.203: 44.75,42.61 v2(44.75,31)
M1_ADC: length 29.2
  Top Layer w0.203: U1.34 v2(43.75,26.5)
  Inner1 w0.203: v2(43.75,39.99) 47.76,39.99 v2(51.25,43.48)
  Bottom Layer w0.203: v2(43.75,26.5) 43.75,27.41 43.97,27.64 43.97,28.03 43.75,28.25 v2(43.75,39.99) ; FPC1.10 51.25,43.48
M1_ADC_A: length 45
  Top Layer w0.203: v2(31.5,22.47) U1.15
  Bottom Layer w0.203: v2(31.5,22.47) 31.5,21.83 34.2,19.13 36.23,19.13 37.07,18.3 43.32,18.3 46.24,21.22 49.26,21.22 51.25,23.2 51.25,41.48 51.75,41.98 51.75,42.62
M1_ADC_C: length 44.7
  Top Layer w0.203: v2(32,22.04) U1.16
  Inner2 w0.203: v2(32,22.04) 33.41,20.63 34.06,20.63 v2(36.9,17.79)
  Bottom Layer w0.203: FPC1.8 52.25,41.98 51.75,41.48 51.75,22.79 49.56,20.61 46.47,20.61 43.65,17.79 v2(36.9,17.79)
M1_BK_BUTTON: length 35.8
  Top Layer w0.203: 60.44,9.32 v2(55.52,9.32) 55.09,8.89 SW4.2 SW4.1 ; 57.78,9.18 C33.2 ; v2(39.41,25.5) 38.9,25 U1.31
  Inner2 w0.203: v2(55.52,9.32) 55.52,9.39 v2(39.41,25.5)
M1_BK_OUT: length 31
  Top Layer w0.203: v2(25.5,22.04) 25.5,20.55
  Inner1 w0.203: v2(43.75,40.86) 40.79,37.9 v2(40.2,37.9)
  Bottom Layer w0.203: v2(25.5,22.04) 25.5,25.09 38.31,37.9 40.11,37.9 40.11,37.9 ; 43.75,42.66 v2(43.75,40.86)
M1_I2C2_SCL: length 71.8
  Top Layer w0.203: U1.47 37.12,33 37.12,33 v2(36.82,33) ; v2(90.47,37.76) FPC3.2
  Inner2 w0.203: v2(36.82,33) 36.82,32.03 43.65,25.2 68.84,25.2 70.12,26.47 75.78,26.47 87.06,37.76 v2(90.47,37.76)
  Bottom Layer w0.203: CN3.3 91.08,32.56 91.3,32.77 91.3,36.93 v2(90.47,37.76)
M1_I2C2_SDA: length 69.1
  Top Layer w0.203: v2(90.47,38.76) FPC3.3 ; v2(39.14,33.5) U1.48
  Inner2 w0.203: v2(39.14,33.5) 40.46,33.5 48.25,25.72 68.42,25.72 69.84,27.14 75.25,27.14 86.87,38.76 v2(90.47,38.76)
  Bottom Layer w0.203: v2(90.47,38.76) 88.58,36.87 88.58,34.09 88.87,33.81 CN3.2
M1_SPI3_CS: length 76.5
  Top Layer w0.203: v2(90.76,16.44) 89.67,16.44 ; v2(24.04,34) U1.77
  Inner1 w0.203: v2(88.55,16.06) 78.64,25.98 43.51,25.98 43.07,26.42 33.22,26.42 25.64,34 v2(24.04,34)
  Bottom Layer w0.203: v2(90.76,16.44) 90.38,16.06 U9.5 v2(88.55,16.06)
M1_SPI3_MISO: length 75.3
  Top Layer w0.203: v2(90.76,18.44) FPC5.3 ; v2(24.04,33) U1.79
  Inner1 w0.203: v2(24.04,33) 25.17,33 33.57,24.6 42.94,24.6 43.27,24.93 77.45,24.93 v2(83.8,18.58)
  Bottom Layer w0.203: 89.75,18.56 U9.3 ; 89.75,18.56 90.63,18.56 v2(90.76,18.44) ; 89.75,18.56 89.74,18.58 v2(83.8,18.58) 83.79,18.56
M1_SPI3_MOSI: length 74.5
  Top Layer w0.203: v2(90.76,19.44) FPC5.2 ; U1.80 v2(24.55,32.5)
  Inner1 w0.203: v2(81.51,19.82) 76.84,24.49 43.49,24.49 43.22,24.22 33.15,24.22 24.87,32.5 v2(24.55,32.5)
  Bottom Layer w0.203: v2(90.76,19.44) 90.38,19.81 U9.2 81.51,19.81 v2(81.51,19.82)
M1_SPI3_SCK: length 77.8
  Top Layer w0.203: v2(90.76,17.44) FPC5.4 ; v2(21.86,33.5) U1.78
  Inner1 w0.203: v2(86.23,17.31) 78.09,25.46 43.32,25.46 42.8,25.98 32.91,25.98 25.39,33.5 v2(21.86,33.5)
  Bottom Layer w0.203: v2(90.76,17.44) 90.63,17.31 U9.4 v2(86.23,17.31)
M1_TIM8_CH1: length 29.1
  Top Layer w0.203: v2(54.75,43.48) 53.27,41.99 40.11,41.99 35.55,37.44 30.97,37.44 30.5,36.96 30.5,35.64
  Bottom Layer w0.203: FPC1.3 54.75,43.48
M1_TIM8_CH1N: length 33.4
  Top Layer w0.203: v2(54.75,27.2) 53.28,25.72 40.41,25.72 39.19,24.5 U1.30
  Bottom Layer w0.203: v2(54.75,27.2) 54.75,41.48 55.25,41.98 FPC1.2
M1_TIM8_CH2: length 28.7
  Top Layer w0.203: 30,35.64 30,37.1 30.84,37.94 35.27,37.94 39.86,42.53 52.8,42.53 v2(53.75,43.48)
  Bottom Layer w0.203: FPC1.5 53.75,43.48
M1_TIM8_CH2N: length 33.6
  Top Layer w0.203: 53.75,27.19 53.75,26.76 53.02,26.03 45.74,26.03 44.77,27 U1.35 v2(36.96,27)
  Bottom Layer w0.203: v2(53.75,27.2) 53.75,41.49 54.25,41.98 FPC1.4
M1_TIM8_CH3: length 28.3
  Top Layer w0.203: v2(52.75,43.48) 52.27,43 39.5,43 34.95,38.45 30.72,38.45 29.5,37.23 29.5,35.64
  Bottom Layer w0.203: FPC1.7 52.75,43.48
M1_TIM8_CH3N: length 29.5
  Top Layer w0.203: U1.36 39.29,27.5 40.1,28.31 v2(48.5,28.31)
  Inner1 w0.203: v2(48.5,28.31) 52.75,28.31
  Bottom Layer w0.203: v2(52.75,28.31) 52.75,41.48 53.25,41.98 FPC1.6
MOTOR_EN1: length 30.4
  Top Layer w0.203: v2(26,22.47) U1.4
  Bottom Layer w0.203: v2(26,22.47) 26,24.74 38.68,37.42 41.72,37.42 42.75,38.45 42.75,42.61
MOTOR_EN2: length 29.3
  Top Layer w0.203: v2(40.2,36.91) 42.25,38.95 v2(42.25,41.51) ; 26.5,20.55 v2(26.5,22.04)
  Bottom Layer w0.203: v2(26.5,22.04) 26.5,24.36 39.04,36.91 v2(40.2,36.91) ; 42.25,42.61 v2(42.25,41.51)
NRST: length 28.9
  Top Layer w0.203: SW1.2 13.1,17.39 14.15,18.44 v2(21.79,18.44) ; 14.14,18.44 C28.2 11.83,23.47 ; v2(31,22.04) U1.14
  Bottom Layer w0.203: v2(21.79,18.44) 27.39,18.44 v2(31,22.04)
OSC_IN: length 9.1
  Top Layer w0.203: 30,20.55 30,19.83 30.82,19.01 31.97,19.01 C12.1 33.81,17.16 33.81,15.29 X1.1
OSC_OUT: length 7.8
  Top Layer w0.203: 30.5,20.55 30.5,19.96 31.1,19.36 33.28,19.36 34.59,18.05 C2.1 34.63,16.13 X1.3
OTG_D+: length 31.7
  Top Layer w0.203: USB2.8 54.75,48.37 55.03,48.65 55.48,48.65 55.75,48.38 USB2.6 ; 54.75,47.62 v2(54.75,46.61)
  Bottom Layer w0.203: R18.1 30.76,38.91 30.9,38.76 32.09,38.76 ; 32.09,38.76 32.12,38.76 ; 32.09,38.76 38.14,44.81 41.06,44.81 42.08,45.83 53.97,45.83 v2(54.75,46.61)
OTG_D-: length 31.7
  Top Layer w0.203: USB2.7 55.25,46.98 55.62,46.61 v2(55.75,46.61) 55.88,46.61 56.25,46.97 USB2.5
  Bottom Layer w0.203: R19.1 30.76,38.26 30.9,38.41 32.36,38.41 ; 32.36,38.41 32.4,38.41 ; 32.36,38.41 38.42,44.46 41.24,44.46 42.25,45.47 54.29,45.47 55.43,46.61 v2(55.75,46.61)
PA1: length 35
  Top Layer w0.203: U1.24 36,22.22 36.3,22.52 36.78,22.52 37.17,22.13 v2(37.17,21.3)
  Bottom Layer w0.203: v2(37.17,21.3) 38.14,20.33 42.76,20.33 49.29,26.86 49.29,29.17 48.25,30.21 48.25,42.61
PA7: length 31.6
  Top Layer w0.203: v2(36.96,25.5) U1.32
  Inner2 w0.203: v2(36.96,25.5) 37.93,26.47 37.93,30.18 36.25,31.86 36.25,33.3 36.95,34 48.39,34 v2(49.25,34.86)
  Bottom Layer w0.203: v2(49.25,34.86) 49.75,35.36 FPC1.13
PA9: length 11.2
  Top Layer w0.203: v2(28,34.96) U1.68 ; R8.2 v2(20.63,33.38)
  Bottom Layer w0.203: v2(20.63,33.38) 20.63,34.14 21.73,35.25 23.89,35.25 25.15,33.99 27.03,33.99 v2(28,34.96)
PA10: length 13.4
  Top Layer w0.203: v2(27.5,37.09) U1.69 ; R12.2 v2(20.63,30.72)
  Inner2 w0.203: v2(27.5,37.09) 27.18,37.09 26.46,36.36 22.35,36.36 21.32,35.34 21.32,33.28 20.63,32.59 v2(20.63,30.72)
PA11: length 5.2
  Top Layer w0.203: v2(27,37.58) U1.70
  Bottom Layer w0.203: v2(27,37.58) 27.48,37.58 arc(27.66,37.66) 27.73,37.84 27.73,38.25 arc(27.98,38.5) 28.24,38.25 28.24,37.84 arc(28.31,37.66) 28.49,37.58 29.21,37.58 R19.2
PA12: length 5.2
  Top Layer w0.203: v2(26.5,37.14) U1.71
  Bottom Layer w0.203: R18.2 28.28,39.54 26.5,37.76 v2(26.5,37.14)
PA13: length 70.1
  Top Layer w0.203: v2(26,34.96) U1.72
  Inner2 w0.203: v2(26,34.96) 26.51,35.47 26.83,35.47 27.26,35.9 39.27,35.9 39.7,35.47 53.74,35.47 61.3,43.03 v2(85.01,43.03)
  Bottom Layer w0.203: H1.5 H1.6 ; 83.4,43.03 v2(85.01,43.03)
PA14: length 75.5
  Top Layer w0.203: v2(21.86,34.5) U1.76
  Inner2 w0.203: v2(85.11,45.58) 60.62,45.58 51.08,36.04 39.85,36.04 39.44,36.44 27.17,36.44 26.58,35.86 23.22,35.86 v2(21.86,34.5)
  Bottom Layer w0.203: 83.51,45.58 v2(85.11,45.58) ; H1.3 H1.4
PB3: length 54.5
  Top Layer w0.203: v2(33.08,28.5) 32.58,28 U1.89
  Inner1 w0.203: v2(71.33,30.6) 59.47,30.6 56.05,34.02 38.6,34.02 v2(33.08,28.5)
  Bottom Layer w0.203: 73.53,30.6 v2(71.33,30.6)
PB4: length 54.2
  Top Layer w0.203: v2(34.13,28.5) 33.13,27.5 U1.90
  Inner1 w0.203: v2(34.13,28.5) 38.65,33.02 56.22,33.02 59.35,29.9 v2(71.33,29.9)
  Bottom Layer w0.203: 73.53,29.9 v2(71.33,29.9)
PB5: length 57.6
  Top Layer w0.203: v2(30.03,26.59) 29.63,27 U1.91
  Inner1 w0.203: v2(33.88,30.45) 33.88,32.27 37.52,35.9 41.59,35.9 41.93,35.56 55.53,35.56 59.8,31.3 v2(71.33,31.3)
  Inner2 w0.203: v2(30.03,26.59) 33.88,30.45 v2(33.88,30.45)
  Bottom Layer w0.203: 73.53,31.3 v2(71.33,31.3)
PC2: length 43.8
  Top Layer w0.203: v2(32.5,22.47) U1.17 ; v2(50.75,32.53) 48.75,34.53 v2(48.75,40.28)
  Bottom Layer w0.203: v2(50.75,32.53) 50.75,23.45 49.08,21.78 45.97,21.78 43.01,18.81 ; FPC1.15 48.75,40.28 ; 43.01,18.79 37.44,18.79 36.71,19.52 34.4,19.52 32.5,21.42 v2(32.5,22.47)
PC3: length 38.7
  Top Layer w0.203: v2(33,22.04) U1.18
  Inner1 w0.203: v2(40.66,19.29) 37.22,19.29 36.23,20.28 34.76,20.28 v2(33,22.04)
  Bottom Layer w0.203: FPC1.14 49.25,35.71 48.7,35.16 48.7,30.45 49.76,29.39 49.76,26.53 42.53,19.29 v2(40.66,19.29)
PC9: length 26.1
  Top Layer w0.203: v2(50.25,43.65) 39.4,43.65 34.72,38.97 30.72,38.97 29,37.25 U1.66
  Bottom Layer w0.203: v2(50.25,43.65) FPC1.12
PD3: length 53.7
  Top Layer w0.203: U1.84 24.22,30.5 25.21,29.5 v2(36.01,29.5)
  Inner1 w0.203: v2(71.33,29.2) 59.26,29.2 58.21,30.25 47.48,30.25 45.14,32.6 40.84,32.6 37.75,29.5 v2(36.01,29.5)
  Bottom Layer w0.203: 73.53,29.2 v2(71.33,29.2)
PD4: length 86.5
  Top Layer w0.203: v2(24.04,30) U1.85
  Inner1 w0.203: v2(38.16,14.44) 36.02,12.29 26.39,12.29 23.56,15.12 23.56,27.52 24.52,28.48 24.52,29.52 v2(24.04,30)
  Inner2 w0.203: v2(38.16,14.44) 49.47,14.44 55.36,8.54 71.23,8.54 75.42,12.73 v2(75.42,17.07)
  Bottom Layer w0.203: v2(75.42,17.07) R17.2 77.99,16.06 78.85,16.92 U6.2 U6.3
PD5: length 86
  Top Layer w0.203: v2(21.86,29.5) U1.86
  Inner1 w0.203: v2(38.16,12.94) 36.29,11.06 26.06,11.06 22.71,14.42 22.71,28.65 v2(21.86,29.5)
  Inner2 w0.203: v2(81.39,15.15) 73.72,7.47 54.29,7.47 48.83,12.94 v2(38.16,12.94)
  Bottom Layer w0.203: U6.4 v2(81.39,15.15)
PD6: length 81.8
  Top Layer w0.203: v2(24.04,29) U1.87
  Inner1 w0.203: v2(24.04,29) 23.13,28.08 23.13,14.77 26.21,11.68 36.17,11.68 v2(38.16,13.67)
  Inner2 w0.203: 76.97,18.35 76.97,13.39 71.56,7.98 54.8,7.98 49.11,13.67 v2(38.16,13.67)
  Bottom Layer w0.203: U6.1 v2(76.97,18.33)
PD7: length 53.5
  Top Layer w0.203: U1.88 31.09,28.5 31.6,29 v2(35.5,29)
  Inner1 w0.203: v2(35.5,29) 38.15,29 41.13,31.99 44.84,31.99 47.12,29.71 57.94,29.71 59.15,28.5 v2(71.33,28.5)
  Bottom Layer w0.203: 73.53,28.5 v2(71.33,28.5)
TEST_LED: length 18.1
  Top Layer w0.203: LED4.1 12.38,27.8 17.82,27.8 18.45,27.16 18.45,25.49 v2(21.57,22.36) ; v2(24.5,22.04) 24.5,20.55
  Bottom Layer w0.203: v2(21.57,22.36) 24.18,22.36 v2(24.5,22.04)
USB+: length 2.8
  Bottom Layer w0.203: 33.15,45.86 33.1,45.86 32.67,45.44 32.42,45.44 32.41,45.45 31.77,45.45 31.67,45.55 U5.1
USB-: length 2.8
  Bottom Layer w0.203: D3.4 33,43.97 32.57,44.39 32.42,44.39 32.41,44.38 31.77,44.38 31.67,44.28 U5.2
USB_VCC: length 29.7
  Top Layer w0.305: 54.23,49.24 53.1,48.11 USB2.11 ; 54.23,49.24 56.77,49.24 57.91,48.1 57.91,47.63 USB2.2 57.9,46.97 v1(59.19,45.68) ; 54.23,49.24 53.32,50.15 43.68,50.15 42.77,49.23 ; 42.77,49.23 40.23,49.23 39.1,48.11 USB1.11 ; 42.77,49.23 43.91,48.1 43.91,47.63 USB1.2
  Bottom Layer w0.305: F1.1 v1(59.19,45.68)
VREF: length 48.6
  Top Layer w0.203: v2(59.75,27.13) 58.73,27.13 49.46,17.86 v2(45.96,17.86) ; R4.2 v2(40.62,16.3) ; 34.5,22.12 U1.21
  Inner2 w0.203: v2(40.62,16.3) 40.62,17.86 ; 40.62,17.86 v2(45.96,17.86) ; 40.62,17.86 38.08,17.86 34.5,21.44 v2(34.5,22.04)
  Bottom Layer w0.203: U2.2 65.62,34.51 C11.2 v2(59.75,27.13)
$1N4607: length 3.7
  Top Layer w0.203: R6.1 64.73,46.9 LED3.1
$1N5052: length 2.5
  Top Layer w0.203: 25.5,35.64 25.5,38.13 C13.2
$1N8262: length 2.7
  Top Layer w0.203: 12.28,45.36 v2(12.28,44.05)
  Bottom Layer w0.203: v2(12.28,44.05) 13.16,44.93 U4.3
$1N11541: length 2.5
  Top Layer w0.203: U1.49 40.59,34 C23.2
$1N13723: length 3
  Bottom Layer w0.203: C26.1 25.16,45.54
  Bottom Layer w0.305: 25.16,45.54 U5.8
$1N14257: length 6.8
  Bottom Layer w0.305: R2.1 65.58,35.97 67.39,34.16 68.65,34.16 68.96,34.46 R3.2
$1N21384: length 4.1
  Top Layer w0.203: Q3.1 62.74,13.04 R27.2 R30.1
$1N21387: length 17.4
  Top Layer w0.305: v1(60.78,15.81) 59.89,15.81
  Bottom Layer w0.305: v1(60.78,15.81) 69.97,25 73.53,25
$1N21388: length 14.9
  Top Layer w0.305: Q3.3 63.69,18.06 66.84,21.21 v1(66.84,22.99)
  Bottom Layer w0.305: 73.53,25.7 69.54,25.7 v1(66.84,22.99)
$1N24716: length 4.5
  Top Layer w0.203: R25.2 51.93,29.15 50.72,30.36 U10.2
$1N25477: length 9.1
  Top Layer w0.203: v2(80.11,8.39) CN1.3
  Bottom Layer w0.203: R22.1 82.94,9.41 ; R22.1 80.24,10.05 79.67,10.62 79.67,11.29 80.12,11.75 U6.6 ; R22.1 80.24,9.26 80.11,9.14 v2(80.11,8.39)
$1N25478: length 9.1
  Top Layer w0.203: v2(78.86,8.39) CN1.2
  Bottom Layer w0.203: U6.7 78.85,11.75 79.31,11.29 79.31,10.62 78.73,10.05 R22.2 ; v2(78.86,8.39) 78.86,9.14 78.73,9.26 R22.2 ; R22.2 76.03,9.41
$1N28487: length 2.3
  Top Layer w0.203: R15.2 42.75,46 42.75,47.62 USB1.4
$1N28620: length 2.1
  Top Layer w0.203: USB1.10 39.75,45.52
$1N28747: length 2.3
  Top Layer w0.203: USB2.4 56.75,46 R16.2
$1N28749: length 2.1
  Top Layer w0.203: USB2.10 R23.2
$1N31567: length 3.2
  Bottom Layer w0.305: D4.2 F1.2
$1N34636: length 3.2
  Top Layer w0.203: 16.36,30.72 13.12,30.72
$1N34643: length 3.2
  Top Layer w0.203: 15.74,33.39 15.75,33.38 ; 15.74,33.39 16.35,33.39 ; 15.74,33.39 13.13,33.39
$1N34651: length 3.7
  Top Layer w0.203: R13.1 32.27,46.9 LED5.1
$1N41751: length 3
  Top Layer w0.203: LED4.2 16.25,27.04 16.26,27.04
$1N56661: length 3.1
  Top Layer w0.305: U1.6 27,17.81
$1N85266: length 15.6
  Top Layer w0.305: C3.1 25.19,42.52 25.19,40.35 26.46,39.08 ; C3.1 D1.1 ; C3.1 21.58,43.7 C4.2 ; Q1.3 30,39.59 29.48,39.08 26.49,39.08
$1N85309: length 9.5
  Top Layer w0.203: 74.07,43.7 74.09,43.72
  Top Layer w0.305: C7.1 75.42,43.7 C8.2 ; C7.1 D2.1 ; C7.1 73,43.64 Q2.3
$1N95889: length 24.5
  Bottom Layer w0.305: FPC1.30 FPC1.29
  Bottom Layer w0.508: 41.51,42.62 41.51,43.4 42.55,44.44 56.68,44.44 61.93,39.19 D5.2
$1N102744: length 123.3
  Inner1 w0.381: v2(62.49,50.68) 80,50.68 82.25,52.93 86.38,52.93 93.2,46.11 93.2,15.53 90.38,12.71 v2(71.61,12.71)
  Inner2 w0.381: v2(56.81,23.35) 57.97,23.35 65.37,15.96 68.36,15.96 v2(71.61,12.71)
  Bottom Layer w0.305: U12.15 v2(56.81,23.35) ; LED6.1 48.76,52.81 50.89,50.68 v2(62.49,50.68)
$1N102783: length 2
  Bottom Layer w0.305: R32.1 LED6.2
$1N102997: length 2.7
  Bottom Layer w0.305: LED7.2 82.93,50.63
$1N103001: length 86.4
  Inner1 w0.381: v2(85.11,51.96) 92.24,44.83 92.24,15.82 89.94,13.52 v2(68.69,13.52)
  Inner2 w0.381: v2(68.69,13.52) 68.69,14.36 67.83,15.22 64.84,15.22 v2(57.36,22.69)
  Bottom Layer w0.305: v2(85.11,51.96) 81.1,51.96 LED7.1 ; v2(57.36,22.69) 57.35,22.7 U12.14
$1N103337: length 2
  Bottom Layer w0.305: R34.1 LED8.2
$1N103341: length 46
  Inner2 w0.381: v2(67.5,14.44) 64.42,14.44 v2(56.81,22.05)
  Bottom Layer w0.305: U12.13 v2(56.81,22.05) ; LED8.1 92.59,25.35 91.4,24.16 90.43,24.16 86.83,20.56 75.7,20.56 69.58,14.44 v2(67.5,14.44)
$1N103422: length 3.2
  Bottom Layer w0.305: R35.1 LED9.2
$1N103426: length 33.9
  Bottom Layer w0.305: LED9.1 70.85,4.15 58.3,16.7 58.3,19.97 56.88,21.4 U12.12
$1N103507: length 3.2
  Bottom Layer w0.305: R36.1 LED10.2
$1N103511: length 24.2
  Bottom Layer w0.305: U12.11 56.36,20.75 57.16,19.95 57.16,17.69 46.44,6.97 46.44,4.48 46.77,4.15 LED10.1
$1N103592: length 2.1
  Bottom Layer w0.305: LED11.2 R38.1
$1N103596: length 61.2
  Bottom Layer w0.305: U12.10 54.32,20.1 45.59,11.38 26.35,11.38 12.82,24.91 5.42,24.91 4.41,25.92 LED11.1
$1N103677: length 3.1
  Bottom Layer w0.305: R39.1 LED13.2
$1N103681: length 45
  Bottom Layer w0.305: 55.39,19.45 46.7,10.76 26.31,10.76 19.7,4.15 LED13.1
$1N103762: length 3.6
  Bottom Layer w0.305: R37.1 19.28,50.63 LED12.2
$1N103766: length 98.6
  Top Layer w0.305: v2(62.4,20.1) 52.6,20.1
  Bottom Layer w0.305: LED12.1 13.88,52.81 5.32,44.25 5.32,30.94 6.23,30.03 9.94,30.03 11.92,28.05 11.92,26.73 26.67,11.98 44.48,11.98 v2(52.6,20.1) ; 61.12,20.1 v2(62.4,20.1)
$1N129348: length 5.7
  Top Layer w0.203: 14.65,45.37 v2(14.65,44.06)
  Bottom Layer w0.203: U4.4 15.71,45.12 v2(14.65,44.06)

## Copper pours and planes (outline as drawn; the poured copper is in the pictures)
DGND on Top Layer: -4.94,60.62 99.86,60.62 99.86,-2.85 -4.94,-2.85
DGND on Bottom Layer: -4.94,60.62 99.86,60.62 99.86,-2.85 -4.94,-2.85
DGND on Inner1: -4.94,60.62 99.86,60.62 99.86,-2.85 -4.94,-2.85
DGND on Inner2: -4.94,60.62 99.86,60.62 99.86,-2.85 -4.94,-2.85

Small or netless copper shapes (teardrops, artwork), in the pictures only: 323 on Top Layer, 288 on Bottom Layer, 61 on Inner1, 55 on Inner2

## Text on the board
Bottom Silkscreen Layer: - DC | - RES | - CS | 120 | Motor_Ctrl
Top Silkscreen Layer: JLCJLCJLCJLC | SCREWS | TEST-PE2 | TX-PA9 | RX-PA10 | 0 | H | L | + | B | A | D | MISO | MOSI | SCK | GND | SDA | 3.3 | CS | SCL | B0/B1 | OFF | SW | SWCLK | SWDIO | 3.3V | link | M4x4 | 240x135 | LIGHT | CAN | I2C1 | SPI2 | BOOT | RST | ON | M0·BK | M1·BK | TFT | RS485 | SPI1 | ST | SPI3 | I2C2 | MOTOR0 | USB2 | USB1 | MOTOR1
